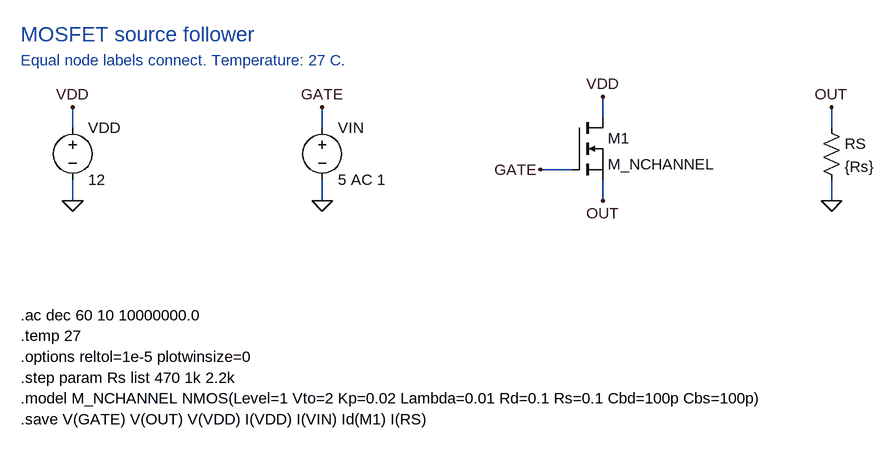
[diagram p0: schematic mosfet-source-follower.asc]
mosfet-source-follower.asc, the LTspice schematic file:
Version 4
SHEET 1 1740 776
WIRE 144 176 144 144
WIRE 144 256 144 288
WIRE 528 176 528 144
WIRE 528 256 528 288
WIRE 960 160 960 128
WIRE 912 240 864 240
WIRE 960 256 960 288
WIRE 1312 176 1312 144
WIRE 1312 256 1312 288
FLAG 144 144 VDD
FLAG 144 288 0
FLAG 528 144 GATE
FLAG 528 288 0
FLAG 960 128 VDD
FLAG 864 240 GATE
FLAG 960 288 OUT
FLAG 1312 144 OUT
FLAG 1312 288 0
SYMBOL voltage 144 160 R0
SYMATTR InstName VDD
SYMATTR Value 12
SYMBOL voltage 528 160 R0
SYMATTR InstName VIN
SYMATTR Value 5 AC 1
SYMBOL nmos 912 160 R0
SYMATTR InstName M1
SYMATTR Value M_NCHANNEL
SYMBOL res 1296 160 R0
SYMATTR InstName RS
SYMATTR Value {Rs}
TEXT 64 32 Left 3 ;MOSFET source follower
TEXT 64 72 Left 2 ;Equal node labels connect. Temperature: 27 C.
TEXT 64 464 Left 2 !.ac dec 60 10 10000000.0
TEXT 64 496 Left 2 !.temp 27
TEXT 64 528 Left 2 !.options reltol=1e-5 plotwinsize=0
TEXT 64 560 Left 2 !.step param Rs list 470 1k 2.2k
TEXT 64 592 Left 2 !.model M_NCHANNEL NMOS(Level=1 Vto=2 Kp=0.02 Lambda=0.01 Rd=0.1 Rs=0.1 Cbd=100p Cbs=100p)
TEXT 64 624 Left 2 !.save V(GATE) V(OUT) V(VDD) I(VDD) I(VIN) Id(M1) I(RS)

The netlist it stands for:
* mosfet-source-follower.asc
VDD VDD 0 12
VIN GATE 0 5 AC 1
M1 VDD GATE OUT OUT M_NCHANNEL
RS OUT 0 {Rs}
.model NMOS NMOS
.model PMOS PMOS
.lib standard.mos
* MOSFET source follower
* Equal node labels connect. Temperature: 27 C.
.ac dec 60 10 10000000.0
.temp 27
.options reltol=1e-5 plotwinsize=0
.step param Rs list 470 1k 2.2k
.model M_NCHANNEL NMOS(Level=1 Vto=2 Kp=0.02 Lambda=0.01 Rd=0.1 Rs=0.1 Cbd=100p Cbs=100p)
.save V(GATE) V(OUT) V(VDD) I(VDD) I(VIN) Id(M1) I(RS)
.backanno
.end